# Altium schematic sheet TOP.SchDoc: TAXIMETRE_PCB_MAIN
size A4; Author: YILDIRIM_DOGRU; CompanyName: BARFAS; DrawnBy: YILDIRIM_DOGRU; DocumentNumber: 0
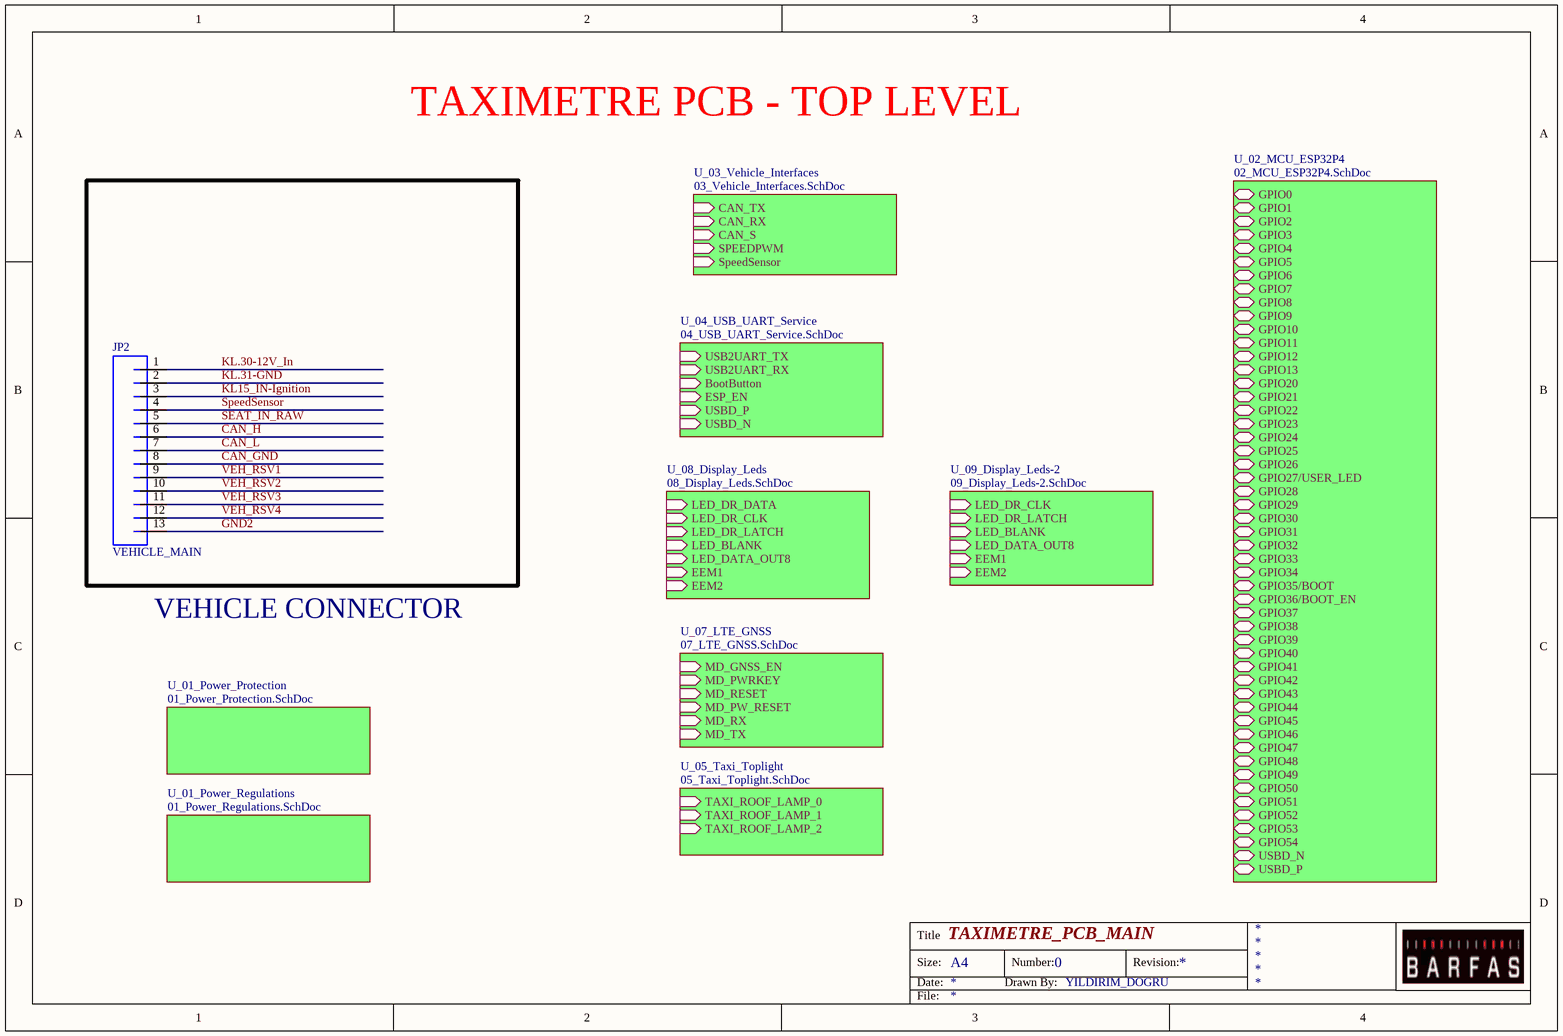
[diagram p0: TOP.SchDoc]

## Parts
JP2  VEHICLE_MAIN  [JST-XH-13-PTH-VERT]

## Sub-sheets
U_01_Power_Protection = 01_Power_Protection.SchDoc: no entries
U_01_Power_Regulations = 01_Power_Regulations.SchDoc: no entries
U_02_MCU_ESP32P4 = 02_MCU_ESP32P4.SchDoc: GPIO0 (bidir), GPIO1 (bidir), GPIO2 (bidir), GPIO3 (bidir), GPIO4 (bidir), GPIO5 (bidir), GPIO6 (bidir), GPIO7 (bidir), GPIO8 (bidir), GPIO9 (bidir), GPIO10 (bidir), GPIO11 (bidir), GPIO12 (bidir), GPIO13 (bidir), GPIO20 (bidir), GPIO21 (bidir), GPIO22 (bidir), GPIO23 (bidir), GPIO24 (bidir), GPIO25 (bidir), GPIO26 (bidir), GPIO27/USER_LED (bidir), GPIO28 (bidir), GPIO29 (bidir), GPIO30 (bidir), GPIO31 (bidir), GPIO32 (bidir), GPIO33 (bidir), GPIO34 (bidir), GPIO35/BOOT (bidir), GPIO36/BOOT_EN (bidir), GPIO37 (bidir), GPIO38 (bidir), GPIO39 (bidir), GPIO40 (bidir), GPIO41 (bidir), GPIO42 (bidir), GPIO43 (bidir), GPIO44 (bidir), GPIO45 (bidir), GPIO46 (bidir), GPIO47 (bidir), GPIO48 (bidir), GPIO49 (bidir), GPIO50 (bidir), GPIO51 (bidir), GPIO52 (bidir), GPIO53 (bidir), GPIO54 (bidir), USBD_N (bidir), USBD_P (bidir)
U_03_Vehicle_Interfaces = 03_Vehicle_Interfaces.SchDoc: CAN_TX (in), CAN_RX (in), CAN_S (in), SPEEDPWM (in), SpeedSensor (in)
U_04_USB_UART_Service = 04_USB_UART_Service.SchDoc: USB2UART_TX (in), USB2UART_RX (in), BootButton (in), ESP_EN (in), USBD_P (in), USBD_N (in)
U_05_Taxi_Toplight = 05_Taxi_Toplight.SchDoc: TAXI_ROOF_LAMP_0 (in), TAXI_ROOF_LAMP_1 (in), TAXI_ROOF_LAMP_2 (in)
U_07_LTE_GNSS = 07_LTE_GNSS.SchDoc: MD_GNSS_EN (in), MD_PWRKEY (in), MD_RESET (in), MD_PW_RESET (in), MD_RX (in), MD_TX (in)
U_08_Display_Leds = 08_Display_Leds.SchDoc: LED_DR_DATA (in), LED_DR_CLK (in), LED_DR_LATCH (in), LED_BLANK (in), LED_DATA_OUT8 (in), EEM1 (in), EEM2 (in)
U_09_Display_Leds-2 = 09_Display_Leds-2.SchDoc: LED_DR_CLK (in), LED_DR_LATCH (in), LED_BLANK (in), LED_DATA_OUT8 (in), EEM1 (in), EEM2 (in)

## Nets
CAN_GND: JP2.8
CAN_H: JP2.6
CAN_L: JP2.7
GND2: JP2.13
KL15_IN-Ignition: JP2.3
KL.30-12V_In: JP2.1
KL.31-GND: JP2.2
SEAT_IN_RAW: JP2.5
SpeedSensor: JP2.4
VEH_RSV1: JP2.9
VEH_RSV2: JP2.10
VEH_RSV3: JP2.11
VEH_RSV4: JP2.12

## Notes on the sheet
- TAXIMETRE PCB - TOP LEVEL
- VEHICLE CONNECTOR
- Title
- Size:
- Date:
- A4
- Drawn By:
- Number:
- Revision:
- File:

## Library data of the parts
JP2 = JST_XH_13_VERT: Manufacturer: JST Sales America, Inc.; PartNumber: B13B-XH-A(LF)(SN); Mounting Technology: Through Hole; PackageReference: JST-XH